# Altium schematic sheet 08_SOM.SchDoc
size 420 x 297 mm; SheetNumber: 13; SheetTotal: 28
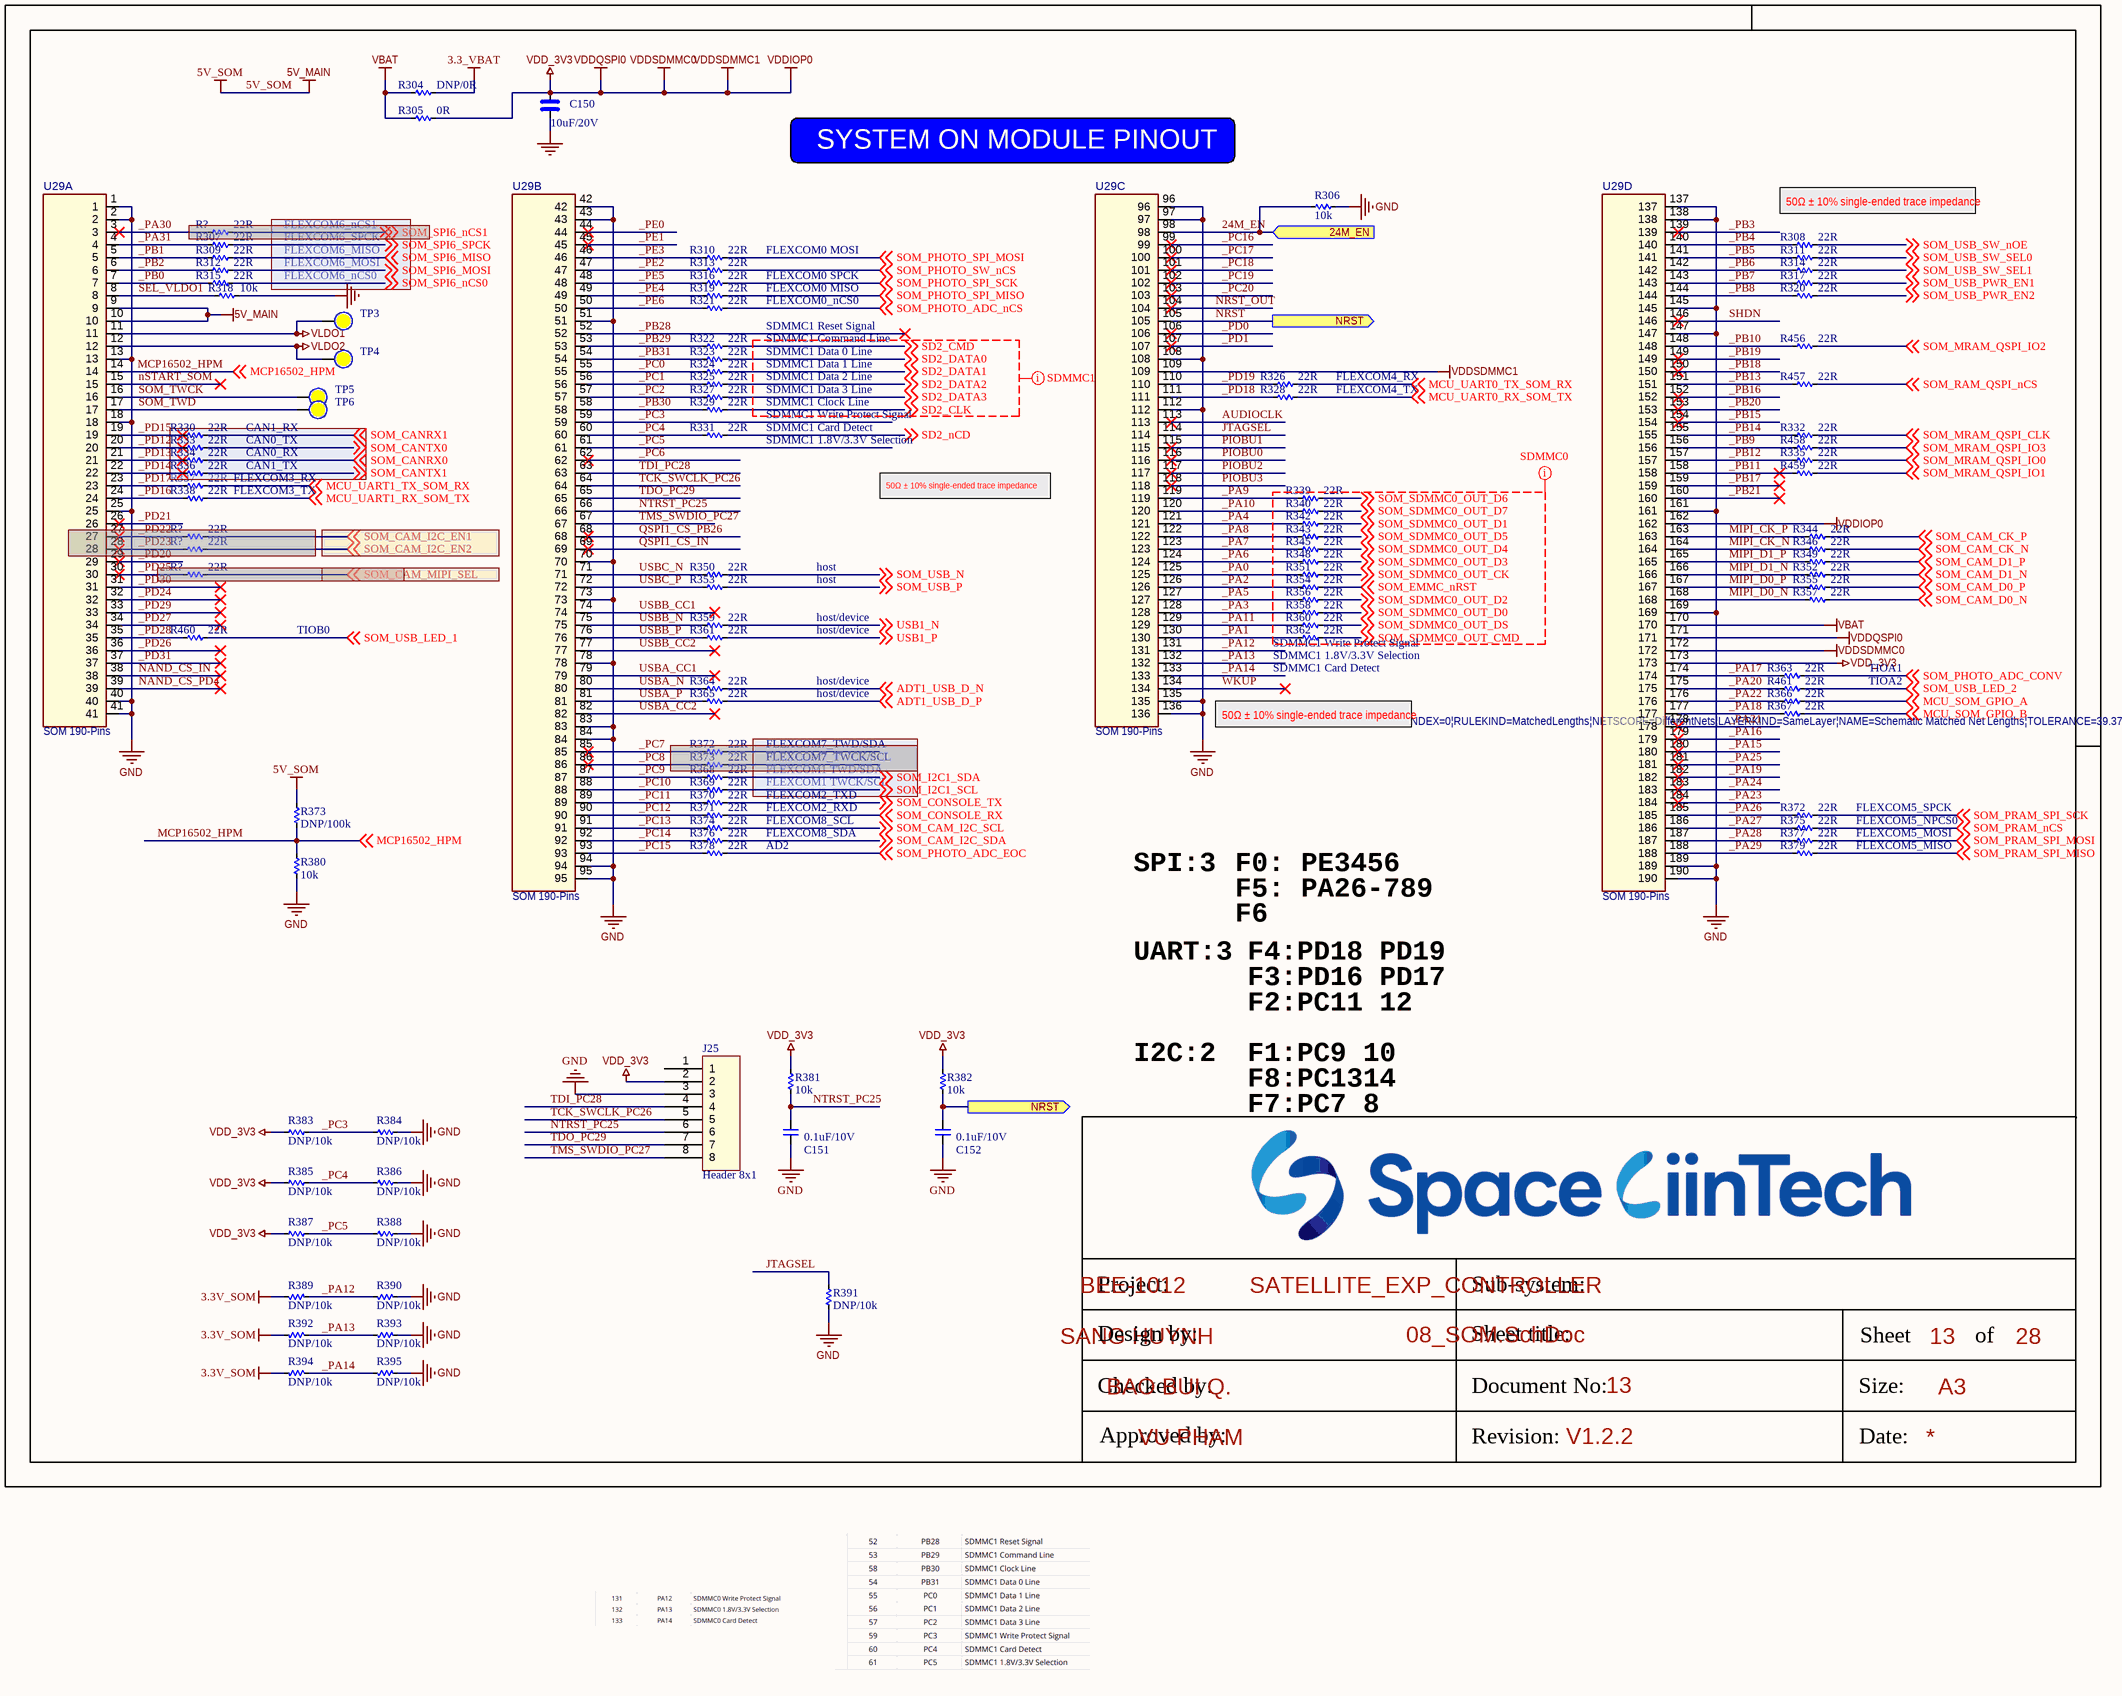
[diagram p0: 08_SOM.SchDoc]

## Parts
(Parts that share a designator on the sheet are numbered #1, #2 ... from top to bottom, then left to right.)
C150  10uF/20V  [CAP_C_2012X110]
C151  0.1uF/10V  [CAP_C_1005X60]
C152  0.1uF/10V  [CAP_C_1005X60]
J25  Header 8x1  [Header_254P_8x1]
R304  DNP/0R  [RES_C_1005X40]
R305  0R  [RES_C_1005X40]
R306  10k  [RES_C_1005X40]
R307  22R  [RES_C_1005X40]
R308  22R  [RES_C_1005X40]
R309  22R  [RES_C_1005X40]
R310  22R  [RES_C_1005X40]
R311  22R  [RES_C_1005X40]
R312  22R  [RES_C_1005X40]
R313  22R  [RES_C_1005X40]
R314  22R  [RES_C_1005X40]
R315  22R  [RES_C_1005X40]
R316  22R  [RES_C_1005X40]
R317  22R  [RES_C_1005X40]
R318  10k  [RES_C_1005X40]
R319  22R  [RES_C_1005X40]
R320  22R  [RES_C_1005X40]
R321  22R  [RES_C_1005X40]
R322  22R  [RES_C_1005X40]
R323  22R  [RES_C_1005X40]
R324  22R  [RES_C_1005X40]
R325  22R  [RES_C_1005X40]
R326  22R  [RES_C_1005X40]
R327  22R  [RES_C_1005X40]
R328  22R  [RES_C_1005X40]
R329  22R  [RES_C_1005X40]
R330  22R  [RES_C_1005X40]
R331  22R  [RES_C_1005X40]
R332  22R  [RES_C_1005X40]
R333  22R  [RES_C_1005X40]
R334  22R  [RES_C_1005X40]
R335  22R  [RES_C_1005X40]
R336  22R  [RES_C_1005X40]
R337  22R  [RES_C_1005X40]
R338  22R  [RES_C_1005X40]
R339  22R  [RES_C_1005X40]
R340  22R  [RES_C_1005X40]
R342  22R  [RES_C_1005X40]
R343  22R  [RES_C_1005X40]
R344  22R  [RES_C_1005X40]
R345  22R  [RES_C_1005X40]
R346  22R  [RES_C_1005X40]
R348  22R  [RES_C_1005X40]
R349  22R  [RES_C_1005X40]
R350  22R  [RES_C_1005X40]
R351  22R  [RES_C_1005X40]
R352  22R  [RES_C_1005X40]
R353  22R  [RES_C_1005X40]
R354  22R  [RES_C_1005X40]
R355  22R  [RES_C_1005X40]
R356  22R  [RES_C_1005X40]
R357  22R  [RES_C_1005X40]
R358  22R  [RES_C_1005X40]
R359  22R  [RES_C_1005X40]
R360  22R  [RES_C_1005X40]
R361  22R  [RES_C_1005X40]
R362  22R  [RES_C_1005X40]
R363  22R  [RES_C_1005X40]
R364  22R  [RES_C_1005X40]
R365  22R  [RES_C_1005X40]
R366  22R  [RES_C_1005X40]
R367  22R  [RES_C_1005X40]
R368  22R  [RES_C_1005X40]
R369  22R  [RES_C_1005X40]
R370  22R  [RES_C_1005X40]
R371  22R  [RES_C_1005X40]
R372#1  22R  [RES_C_1005X40]  (masked out: inside a compile mask, not in the netlist)
R372#2  22R  [RES_C_1005X40]
R373#1  22R  [RES_C_1005X40]  (masked out: inside a compile mask, not in the netlist)
R373#2  DNP/100k  [RES_C_1005X40]
R374  22R  [RES_C_1005X40]
R375  22R  [RES_C_1005X40]
R376  22R  [RES_C_1005X40]
R377  22R  [RES_C_1005X40]
R378  22R  [RES_C_1005X40]
R379  22R  [RES_C_1005X40]
R380  10k  [RES_C_1005X40]
R381  10k  [RES_C_1005X40]
R382  10k  [RES_C_1005X40]
R383  DNP/10k  [RES_C_1005X40]
R384  DNP/10k  [RES_C_1005X40]
R385  DNP/10k  [RES_C_1005X40]
R386  DNP/10k  [RES_C_1005X40]
R387  DNP/10k  [RES_C_1005X40]
R388  DNP/10k  [RES_C_1005X40]
R389  DNP/10k  [RES_C_1005X40]
R390  DNP/10k  [RES_C_1005X40]
R391  DNP/10k  [RES_C_1005X40]
R392  DNP/10k  [RES_C_1005X40]
R393  DNP/10k  [RES_C_1005X40]
R394  DNP/10k  [RES_C_1005X40]
R395  DNP/10k  [RES_C_1005X40]
R456  22R  [RES_C_1005X40]
R457  22R  [RES_C_1005X40]
R458  22R  [RES_C_1005X40]
R459  22R  [RES_C_1005X40]
R460  22R  [RES_C_1005X40]
R461  22R  [RES_C_1005X40]
R?#1  22R  [RES_C_1005X40]  (masked out: inside a compile mask, not in the netlist)
R?#2  22R  [RES_C_1005X40]  (masked out: inside a compile mask, not in the netlist)
R?#3  22R  [RES_C_1005X40]  (masked out: inside a compile mask, not in the netlist)
R?#4  22R  [RES_C_1005X40]  (masked out: inside a compile mask, not in the netlist)
TP3  (no value)  [Testpoint_TH_D130H80]  (no BOM)
TP4  (no value)  [Testpoint_TH_D130H80]  (no BOM)
TP5  (no value)  [Testpoint_TH_D130H80]  (no BOM)
TP6  (no value)  [Testpoint_TH_D130H80]  (no BOM)
U29  SOM 190-Pins  [SOM-38MMX30MM]  (parts A,B,C,D of 4)  (no BOM)

## Ports
24M_EN (in), NRST (out)

## Nets
3.3_VBAT: R304.1
3.3V_SOM: R389.2 R392.2 R394.2
5V_SOM: R373#2.1 U29.9 U29.10  [also labelled 5V_MAIN]
GND: C150.2 C151.1 C152.1 J25.3 R306.1 R318.1 R380.2 R384.1 R386.1 R388.1 R390.1 R391.1 R393.1 R395.1 U29.1 U29.2 U29.13 U29.18 U29.25 U29.40 U29.41 U29.42 U29.43 U29.51 U29.70 U29.73 U29.78 U29.83 U29.84 U29.94 U29.95 U29.96 U29.97 U29.108 U29.112 U29.135 U29.136 U29.137 U29.138 U29.145 U29.147 U29.161 U29.169 U29.189 U29.190
VBAT: R304.2 R305.2 U29.170
VDD_3V3: C150.1 J25.2 R305.1 R381.2 R382.2 R383.2 R385.2 R387.2 U29.109 U29.162 U29.171 U29.172 U29.173  [also labelled VDDIOP0, VDDQSPI0, VDDSDMMC0, VDDSDMMC1]
VLDO1: TP3.0 U29.11
VLDO2: TP4.0 U29.12
24M_EN: R306.2 U29.98 ; port 24M_EN
_PA0: R351.2 U29.125
_PA1: R362.2 U29.130
_PA2: R354.2 U29.126
_PA3: R358.2 U29.128
_PA4: R342.2 U29.121
_PA5: R356.2 U29.127
_PA6: R348.2 U29.124
_PA7: R345.2 U29.123
_PA8: R343.2 U29.122
_PA9: R339.2 U29.119
_PA10: R340.2 U29.120
_PA11: R360.2 U29.129
_PA12: R389.1 R390.2 U29.131
_PA13: R392.1 R393.2 U29.132
_PA14: R394.1 R395.2 U29.133
_PA15: U29.180
_PA16: U29.179
_PA17: R363.2 U29.174
_PA18: R367.2 U29.177
_PA19: U29.182
_PA20: R461.2 U29.175
_PA21: U29.178
_PA22: R366.2 U29.176
_PA23: U29.184
_PA24: U29.183
_PA25: U29.181
_PA26: R372#2.2 U29.185
_PA27: R375.2 U29.186
_PA28: R377.2 U29.187
_PA29: R379.2 U29.188
_PA30: U29.3
_PA31: R307.2 U29.4
_PB0: R315.2 U29.7
_PB1: R309.2 U29.5
_PB2: R312.2 U29.6
_PB3: U29.139
_PB4: R308.2 U29.140
_PB5: R311.2 U29.141
_PB6: R314.2 U29.142
_PB7: R317.2 U29.143
_PB8: R320.2 U29.144
_PB9: R458.2 U29.156
_PB10: R456.2 U29.148
_PB11: R459.2 U29.158
_PB12: R335.2 U29.157
_PB13: R457.2 U29.151
_PB14: R332.2 U29.155
_PB15: U29.154
_PB16: U29.152
_PB17: U29.159
_PB18: U29.150
_PB19: U29.149
_PB20: U29.153
_PB21: U29.160
_PB28: U29.52
_PB29: R322.2 U29.53
_PB30: R329.2 U29.58
_PB31: R323.2 U29.54
_PC0: R324.2 U29.55
_PC1: R325.2 U29.56
_PC2: R327.2 U29.57
_PC3: R383.1 R384.2 U29.59
_PC4: R331.2 R385.1 R386.2 U29.60
_PC5: R387.1 R388.2 U29.61
_PC6: U29.62
_PC7: U29.85
_PC8: U29.86
_PC9: R368.2 U29.87
_PC10: R369.2 U29.88
_PC11: R370.2 U29.89
_PC12: R371.2 U29.90
_PC13: R374.2 U29.91
_PC14: R376.2 U29.92
_PC15: R378.2 U29.93
_PC16: U29.99
_PC17: U29.100
_PC18: U29.101
_PC19: U29.102
_PC20: U29.103
_PD0: U29.106
_PD1: U29.107
_PD12: R333.2 U29.20
_PD13: R334.2 U29.21
_PD14: R336.2 U29.22
_PD15: R330.2 U29.19
_PD16: R338.2 U29.24
_PD17: R337.2 U29.23
_PD18: R328.2 U29.111
_PD19: R326.2 U29.110
_PD20: U29.29
_PD21: U29.26
_PD24: U29.32
_PD25: U29.30
_PD26: U29.36
_PD27: U29.34
_PD28: R460.2 U29.35
_PD29: U29.33
_PD30: U29.31
_PD31: U29.37
_PE0: U29.44
_PE1: U29.45
_PE2: R313.2 U29.47
_PE3: R310.2 U29.46
_PE4: R319.2 U29.49
_PE5: R316.2 U29.48
_PE6: R321.2 U29.50
ADT1_USB_D_N: R364.1 ; off-sheet ADT1_USB_D_N
ADT1_USB_D_P: R365.1 ; off-sheet ADT1_USB_D_P
AUDIOCLK: U29.113
JTAGSEL: R391.2 U29.114
MCP16502_HPM: R373#2.2 R380.1 U29.14 ; off-sheet MCP16502_HPM
MCU_SOM_GPIO_A: R366.1 ; off-sheet MCU_SOM_GPIO_A
MCU_SOM_GPIO_B: R367.1 ; off-sheet MCU_SOM_GPIO_B
MCU_UART0_RX_SOM_TX: R328.1 ; off-sheet MCU_UART0_RX_SOM_TX
MCU_UART0_TX_SOM_RX: R326.1 ; off-sheet MCU_UART0_TX_SOM_RX
MCU_UART1_RX_SOM_TX: R338.1 ; off-sheet MCU_UART1_RX_SOM_TX
MCU_UART1_TX_SOM_RX: R337.1 ; off-sheet MCU_UART1_TX_SOM_RX
MIPI_CK_N: R346.2 U29.164
MIPI_CK_P: R344.2 U29.163
MIPI_D0_N: R357.2 U29.168
MIPI_D0_P: R355.2 U29.167
MIPI_D1_N: R352.2 U29.166
MIPI_D1_P: R349.2 U29.165
NAND_CS_IN: U29.38
NAND_CS_PD4: U29.39
NRST: C152.2 R382.1 U29.105 ; port NRST
NRST_OUT: U29.104
nSTART_SOM: U29.15
NTRST_PC25: C151.2 J25.6 R381.1 U29.66
PIOBU0: U29.116
PIOBU1: U29.115
PIOBU2: U29.117
PIOBU3: U29.118
QSPI1_CS_IN: U29.69
QSPI1_CS_PB26: U29.68
SD2_CLK: R329.1 ; off-sheet SD2_CLK
SD2_CMD: R322.1 ; off-sheet SD2_CMD
SD2_DATA0: R323.1 ; off-sheet SD2_DATA0
SD2_DATA1: R324.1 ; off-sheet SD2_DATA1
SD2_DATA2: R325.1 ; off-sheet SD2_DATA2
SD2_DATA3: R327.1 ; off-sheet SD2_DATA3
SD2_nCD: R331.1 ; off-sheet SD2_nCD
SEL_VLDO1: R318.2 U29.8
SHDN: U29.146
SOM_CAM_CK_N: R346.1 ; off-sheet SOM_CAM_CK_N
SOM_CAM_CK_P: R344.1 ; off-sheet SOM_CAM_CK_P
SOM_CAM_D0_N: R357.1 ; off-sheet SOM_CAM_D0_N
SOM_CAM_D0_P: R355.1 ; off-sheet SOM_CAM_D0_P
SOM_CAM_D1_N: R352.1 ; off-sheet SOM_CAM_D1_N
SOM_CAM_D1_P: R349.1 ; off-sheet SOM_CAM_D1_P
SOM_CAM_I2C_SCL: R374.1 ; off-sheet SOM_CAM_I2C_SCL
SOM_CAM_I2C_SDA: R376.1 ; off-sheet SOM_CAM_I2C_SDA
SOM_CANRX0: R334.1 ; off-sheet SOM_CANRX0
SOM_CANRX1: R330.1 ; off-sheet SOM_CANRX1
SOM_CANTX0: R333.1 ; off-sheet SOM_CANTX0
SOM_CANTX1: R336.1 ; off-sheet SOM_CANTX1
SOM_CONSOLE_RX: R371.1 ; off-sheet SOM_CONSOLE_RX
SOM_CONSOLE_TX: R370.1 ; off-sheet SOM_CONSOLE_TX
SOM_EMMC_nRST: R354.1 ; off-sheet SOM_EMMC_nRST
SOM_I2C1_SCL: R369.1 ; off-sheet SOM_I2C1_SCL
SOM_I2C1_SDA: R368.1 ; off-sheet SOM_I2C1_SDA
SOM_MRAM_QSPI_CLK: R332.1 ; off-sheet SOM_MRAM_QSPI_CLK
SOM_MRAM_QSPI_IO0: R335.1 ; off-sheet SOM_MRAM_QSPI_IO0
SOM_MRAM_QSPI_IO1: R459.1 ; off-sheet SOM_MRAM_QSPI_IO1
SOM_MRAM_QSPI_IO2: R456.1 ; off-sheet SOM_MRAM_QSPI_IO2
SOM_MRAM_QSPI_IO3: R458.1 ; off-sheet SOM_MRAM_QSPI_IO3
SOM_PHOTO_ADC_CONV: R363.1 ; off-sheet SOM_PHOTO_ADC_CONV
SOM_PHOTO_ADC_EOC: R378.1 ; off-sheet SOM_PHOTO_ADC_EOC
SOM_PHOTO_ADC_nCS: R321.1 ; off-sheet SOM_PHOTO_ADC_nCS
SOM_PHOTO_SPI_MISO: R319.1 ; off-sheet SOM_PHOTO_SPI_MISO
SOM_PHOTO_SPI_MOSI: R310.1 ; off-sheet SOM_PHOTO_SPI_MOSI
SOM_PHOTO_SPI_SCK: R316.1 ; off-sheet SOM_PHOTO_SPI_SCK
SOM_PHOTO_SW_nCS: R313.1 ; off-sheet SOM_PHOTO_SW_nCS
SOM_PRAM_nCS: R375.1 ; off-sheet SOM_PRAM_nCS
SOM_PRAM_SPI_MISO: R379.1 ; off-sheet SOM_PRAM_SPI_MISO
SOM_PRAM_SPI_MOSI: R377.1 ; off-sheet SOM_PRAM_SPI_MOSI
SOM_PRAM_SPI_SCK: R372#2.1 ; off-sheet SOM_PRAM_SPI_SCK
SOM_RAM_QSPI_nCS: R457.1 ; off-sheet SOM_RAM_QSPI_nCS
SOM_SDMMC0_OUT_CK: R351.1 ; off-sheet SOM_SDMMC0_OUT_CK
SOM_SDMMC0_OUT_CMD: R362.1 ; off-sheet SOM_SDMMC0_OUT_CMD
SOM_SDMMC0_OUT_D0: R358.1 ; off-sheet SOM_SDMMC0_OUT_D0
SOM_SDMMC0_OUT_D1: R342.1 ; off-sheet SOM_SDMMC0_OUT_D1
SOM_SDMMC0_OUT_D2: R356.1 ; off-sheet SOM_SDMMC0_OUT_D2
SOM_SDMMC0_OUT_D3: R348.1 ; off-sheet SOM_SDMMC0_OUT_D3
SOM_SDMMC0_OUT_D4: R345.1 ; off-sheet SOM_SDMMC0_OUT_D4
SOM_SDMMC0_OUT_D5: R343.1 ; off-sheet SOM_SDMMC0_OUT_D5
SOM_SDMMC0_OUT_D6: R339.1 ; off-sheet SOM_SDMMC0_OUT_D6
SOM_SDMMC0_OUT_D7: R340.1 ; off-sheet SOM_SDMMC0_OUT_D7
SOM_SDMMC0_OUT_DS: R360.1 ; off-sheet SOM_SDMMC0_OUT_DS
SOM_SPI6_MISO: R309.1 ; off-sheet SOM_SPI6_MISO
SOM_SPI6_MOSI: R312.1 ; off-sheet SOM_SPI6_MOSI
SOM_SPI6_nCS0: R315.1 ; off-sheet SOM_SPI6_nCS0
SOM_SPI6_SPCK: R307.1 ; off-sheet SOM_SPI6_SPCK
SOM_TWCK: TP5.0 U29.16
SOM_TWD: TP6.0 U29.17
SOM_USB_LED_1: R460.1 ; off-sheet SOM_USB_LED_1
SOM_USB_LED_2: R461.1 ; off-sheet SOM_USB_LED_2
SOM_USB_N: R350.1 ; off-sheet SOM_USB_N
SOM_USB_P: R353.1 ; off-sheet SOM_USB_P
SOM_USB_PWR_EN1: R317.1 ; off-sheet SOM_USB_PWR_EN1
SOM_USB_PWR_EN2: R320.1 ; off-sheet SOM_USB_PWR_EN2
SOM_USB_SW_nOE: R308.1 ; off-sheet SOM_USB_SW_nOE
SOM_USB_SW_SEL0: R311.1 ; off-sheet SOM_USB_SW_SEL0
SOM_USB_SW_SEL1: R314.1 ; off-sheet SOM_USB_SW_SEL1
TCK_SWCLK_PC26: J25.5 U29.64
TDI_PC28: J25.4 U29.63
TDO_PC29: J25.7 U29.65
TMS_SWDIO_PC27: J25.8 U29.67
USB1_N: R359.1 ; off-sheet USB1_N
USB1_P: R361.1 ; off-sheet USB1_P
USBA_CC1: U29.79
USBA_CC2: U29.82
USBA_N: R364.2 U29.80
USBA_P: R365.2 U29.81
USBB_CC1: U29.74
USBB_CC2: U29.77
USBB_N: R359.2 U29.75
USBB_P: R361.2 U29.76
USBC_N: R350.2 U29.71
USBC_P: R353.2 U29.72
WKUP: U29.134

Not connected (* = marked no-connect by the designer): J25 1; U29 27* 28*

## Layout directives
net class SDMMC0; rule Matched Net Lengths [Tolerance = 1mm]: SOM_EMMC_nRST, SOM_SDMMC0_OUT_CK, SOM_SDMMC0_OUT_CMD, SOM_SDMMC0_OUT_D0, SOM_SDMMC0_OUT_D1, SOM_SDMMC0_OUT_D2, SOM_SDMMC0_OUT_D3, SOM_SDMMC0_OUT_D4, SOM_SDMMC0_OUT_D5, SOM_SDMMC0_OUT_D6, SOM_SDMMC0_OUT_D7, SOM_SDMMC0_OUT_DS
net class SDMMC1; rule Matched Net Lengths [Tolerance = 1mm]: SD2_CLK, SD2_CMD, SD2_DATA0, SD2_DATA1, SD2_DATA2, SD2_DATA3

## Notes on the sheet
- SYSTEM ON MODULE PINOUT
- FLEXCOM6_SPCK
- FLEXCOM6_nCS1
- 50Ω ± 10% single-ended trace impedance
- FLEXCOM6_MOSI
- FLEXCOM6_MISO
- FLEXCOM6_nCS0
- FLEXCOM0 MISO
- FLEXCOM0_nCS0
- FLEXCOM0 SPCK
- FLEXCOM0 MOSI
- SDMMC1 Reset Signal
- SDMMC1 Command Line
- SDMMC1 Data 0 Line
- SDMMC1 Data 1 Line
- CAN1_RX
- SDMMC1 Data 2 Line
- SDMMC1 Data 3 Line
- SDMMC1 Clock Line
- SDMMC1 Write Protect Signal
- SDMMC1 Card Detect
- FLEXCOM4_TX
- FLEXCOM4_RX
- FLEXCOM3_RX
- FLEXCOM3_TX
- CAN0_TX
- CAN0_RX
- CAN1_TX
- SDMMC1 1.8V/3.3V Selection
- host/device
- host
- TIOB0
- (near R362) SDMMC1 Write Protect Signal
- (near R362) SDMMC1 1.8V/3.3V Selection
- TIOA2
- TIOA1
- FLEXCOM7_TWD/SDA
- FLEXCOM1 TWD/SDA
- FLEXCOM1 TWCK/SCL
- FLEXCOM2_TXD
- FLEXCOM2_RXD
- FLEXCOM7_TWCK/SCL
- FLEXCOM5_SPCK
- AD2
- FLEXCOM8_SCL
- FLEXCOM8_SDA
- SPI:3
- F0: PE3456
- FLEXCOM5_NPCS0
- FLEXCOM5_MOSI
- FLEXCOM5_MISO
- F5: PA26-789
- F6
- UART:3
- F4:PD18 PD19
- F3:PD16 PD17
- I2C:2
- F1:PC9 10
- F2:PC11 12
- F8:PC1314
- F7:PC7 8
- Project:
- BEE-1012
- Sub-system:
- SATELLITE_EXP_CONTROLLER
- Design by:
- SANG HUYNH
- BAO BUI Q.
- Sheet title:
- Sheet
- A3
- of
- Checked by:
- Approved by:
- VU PHAM
- Revision:
- Document No:
- V1.2.2
- Size:
- Date:

## Library data of the parts
C150 = _CAP_C_High_2: CAP CHIP High Value
C151 C152 = _CAP_C_2: CAP CHIP
R304-R340 R342-R346 R348-R371 R372#1 R372#2 R373#1 R373#2 R374-R395 R456-R461 R?#1-R?#4 = _RES_B_2: RES
TP3-TP6 = Test Point: Solder: NF
U29 = SOM-190: 190-Castellated thru-holes, 38mm x 30mm package